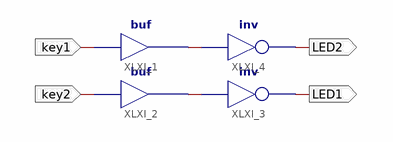
[diagram p0: schematic sheet 1]
// Xilinx ISE schematic testeSCH.sch (xc9500xl) as structural Verilog: 4 symbols, 4 ports
module testeSCH (
  input  key1,
  input  key2,
  output LED1,
  output LED2
);

  wire XLXN_1, XLXN_2;

  buf XLXI_1 (XLXN_2, key1);
  buf XLXI_2 (XLXN_1, key2);
  not XLXI_3 (LED1, XLXN_1);
  not XLXI_4 (LED2, XLXN_2);
endmodule
